# EAGLE design Supply&433Mhz (EAGLE 7.7.0)
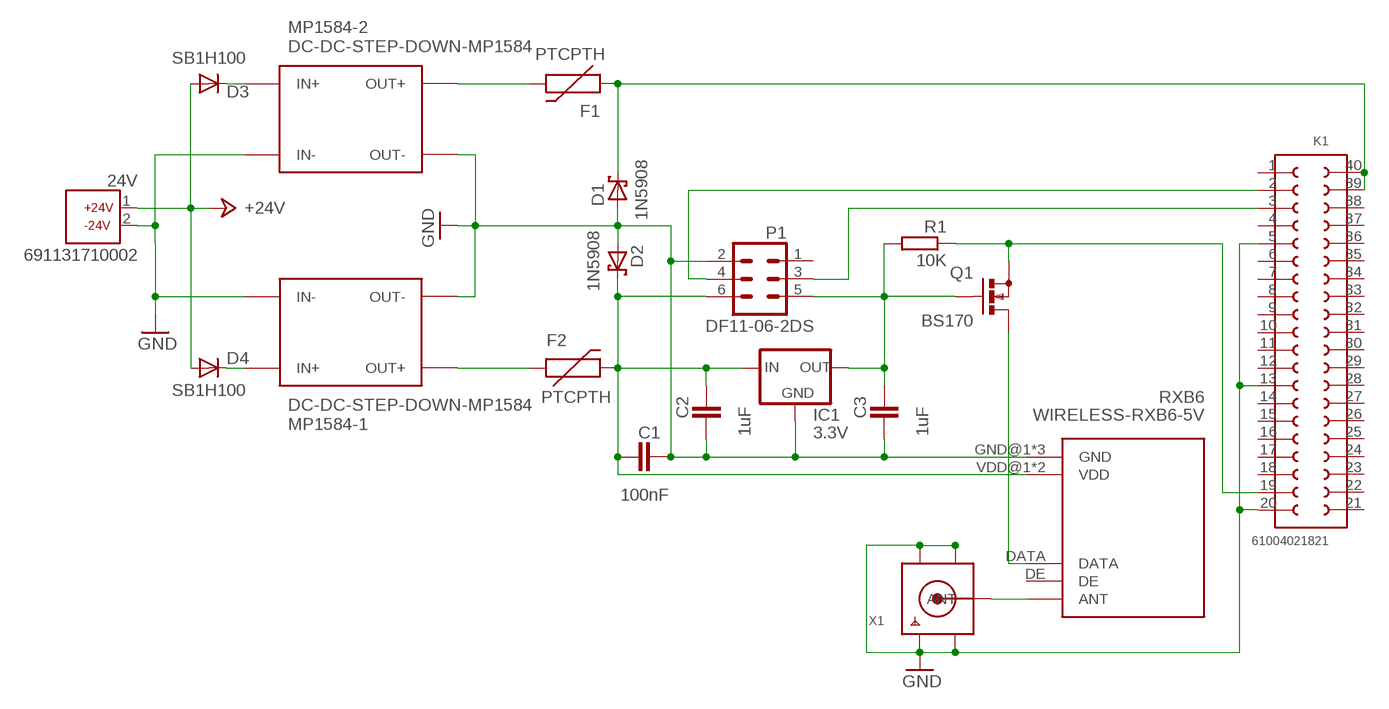
[diagram p0: schematic, sheet 1]

## Parts
24V  691131710002  [691131710002]
C1  100nF  C2,5-3  [C2.5-3]
C2  1uF  C5/3  [C5B3]
C3  1uF  C5/3  [C5B3]
D1  1N5908  [C4111-15]
D2  1N5908  [C4111-15]
D3  SB1H100  DIODE-DO41-7.6  [DO41-7.6]
D4  SB1H100  DIODE-DO41-7.6  [DO41-7.6]
F1  PTCPTH  [PTC]
F2  PTCPTH  [PTC]
IC1  3.3V  MCP1700INLINE  [TO92-INLINE]
K1  61004021821  [61004021821]
MP1584-1  DC-DC-STEP-DOWN-MP1584  [DC-DC-STEP-DOWN-MP1584]
MP1584-2  DC-DC-STEP-DOWN-MP1584  [DC-DC-STEP-DOWN-MP1584]
P1  DF11-06-2DS  [DF11-06DP-2DS]
Q1  BS170  [SOT54E]
R1  10K  R-EU_0204/2V  [0204V]
RXB6  WIRELESS-RXB6-5V  [WIRELESS-RXB6-5V]
X1  SMACONNECTOR  [SMA90_DIP]

## Nets
+24V: 24V.1 D3.A D4.A
GND: 24V.2 C1.1 C2.2 C3.2 D1.A D2.A IC1.1(GND) K1.5 K1.13 K1.20 MP1584-1.IN-0(IN-) MP1584-1.IN-1(IN-) MP1584-1.OUT-0(OUT-) MP1584-1.OUT-1(OUT-) MP1584-2.IN-0(IN-) MP1584-2.IN-1(IN-) MP1584-2.OUT-0(OUT-) MP1584-2.OUT-1(OUT-) P1.2 RXB6.GND@1(GND) RXB6.GND@2(GND) RXB6.GND@3(GND) X1.GND1 X1.GND2 X1.GND3 X1.GND4
N$1: K1.3 P1.3
N$2: C1.2 C2.1 D2.C F2.P$2 IC1.2(IN) P1.6 RXB6.VDD@1(VDD) RXB6.VDD@2(VDD)
N$3: Q1.D RXB6.DATA
N$4: F1.P$2 MP1584-2.OUT+0(OUT+) MP1584-2.OUT+1(OUT+)
N$5: D1.C F1.P$1 K1.39 K1.40
N$6: F2.P$1 MP1584-1.OUT+0(OUT+) MP1584-1.OUT+1(OUT+)
N$7: D3.C MP1584-2.IN+0(IN+) MP1584-2.IN+1(IN+)
N$8: RXB6.ANT X1.ANTENNA(ANT)
N$9: D4.C MP1584-1.IN+0(IN+) MP1584-1.IN+1(IN+)
N$11: C3.1 IC1.3(OUT) P1.5 Q1.G R1.2
N$12: K1.2 P1.4
N$69: K1.19 Q1.S R1.1
Unconnected: K1.1 K1.4 K1.6 K1.7 K1.8 K1.9 K1.10 K1.11 K1.12 K1.14 K1.15 K1.16 K1.17 K1.18 K1.21 K1.22 K1.23 K1.24 K1.25 K1.26 K1.27 K1.28 K1.29 K1.30 K1.31 K1.32 K1.33 K1.34 K1.35 K1.36 K1.37 K1.38 P1.1 RXB6.DE

## Notes on the sheet
- +24V
- -24V

## Library data of the parts
24V = con-wuerth:691131710002: WR-TBL Terminal block - CUU5/2 CUU5/2GR - 2 Pins;=>Code : Con_TBL_Screw_PClamp_5.00_6911317100xx_691131710002 <http://katalog.we-online.de/media/images/eican/Con_TBL_Screw_PClamp_5.00_6911317100xx_pf2.jpg> Details see: http://katalog.we-online.de/em/datasheet/6911317100xx.pdf Created 11/23/2014, Karrer Zheng 2014 (C) Wurth Elektronik
C1-C3 = capacitor-wima:C: CAPACITOR naming: grid - package width
D1 D2 = diode:1N5908: DIODE schottky
D3 D4 = diode:DIODE-: DIODE
F1 F2 = SparkFun-PowerIC:PTC: Resettable Fuse PTC Resettable Fuse. Spark Fun Electronics SKU : COM-08357
IC1 = adafruit:MCP1700: VOLTAGE REGULATOR
K1 = Board_to_Board_Connectors_rev15d:61004021821: WR-PHD 2.54mm Dual SMT Socket Header, 40 Pins=>Code : Con_BTB_SHD_2.54_1_SMT_61000421821 <http://katalog.we-online.de/media/images/eican/Con_BTB_SHD_2.54_1_SMT_6100xx21821_pf2.jpg> Details see: http://katalog.we-online.de/en/em/610_0xx_218_21 Created 2014-05-30, Karrer Zheng 2014 (C) Würth Elektronik
MP1584-1 MP1584-2 = diy-modules:DC-DC-STEP-DOWN-MP1584: DC/DC Step-Down Regulator based on MP1584 chip
P1 = con-hirose-df11:DF11-06-2: HEADER
Q1 = transistor-small-signal:BS170: N-CHANNEL MOS FET; MF: ON SEMICONDUCTOR; MPN: BS170G; OC_FARNELL: 9556192
R1 = rcl:R-EU_: RESISTOR, European symbol; OC_FARNELL: unknown
RXB6 = diy-modules:WIRELESS-RXB6-5V: RF Wireless RXB6-5V Receiver
X1 = adafruit:SMACONNECTOR: SMA Connector 90° DIP SMA Connector, 50 Ohm (4UConnector: 07259)

## Net classes
0 default: clearance 0.205 mm

## Board
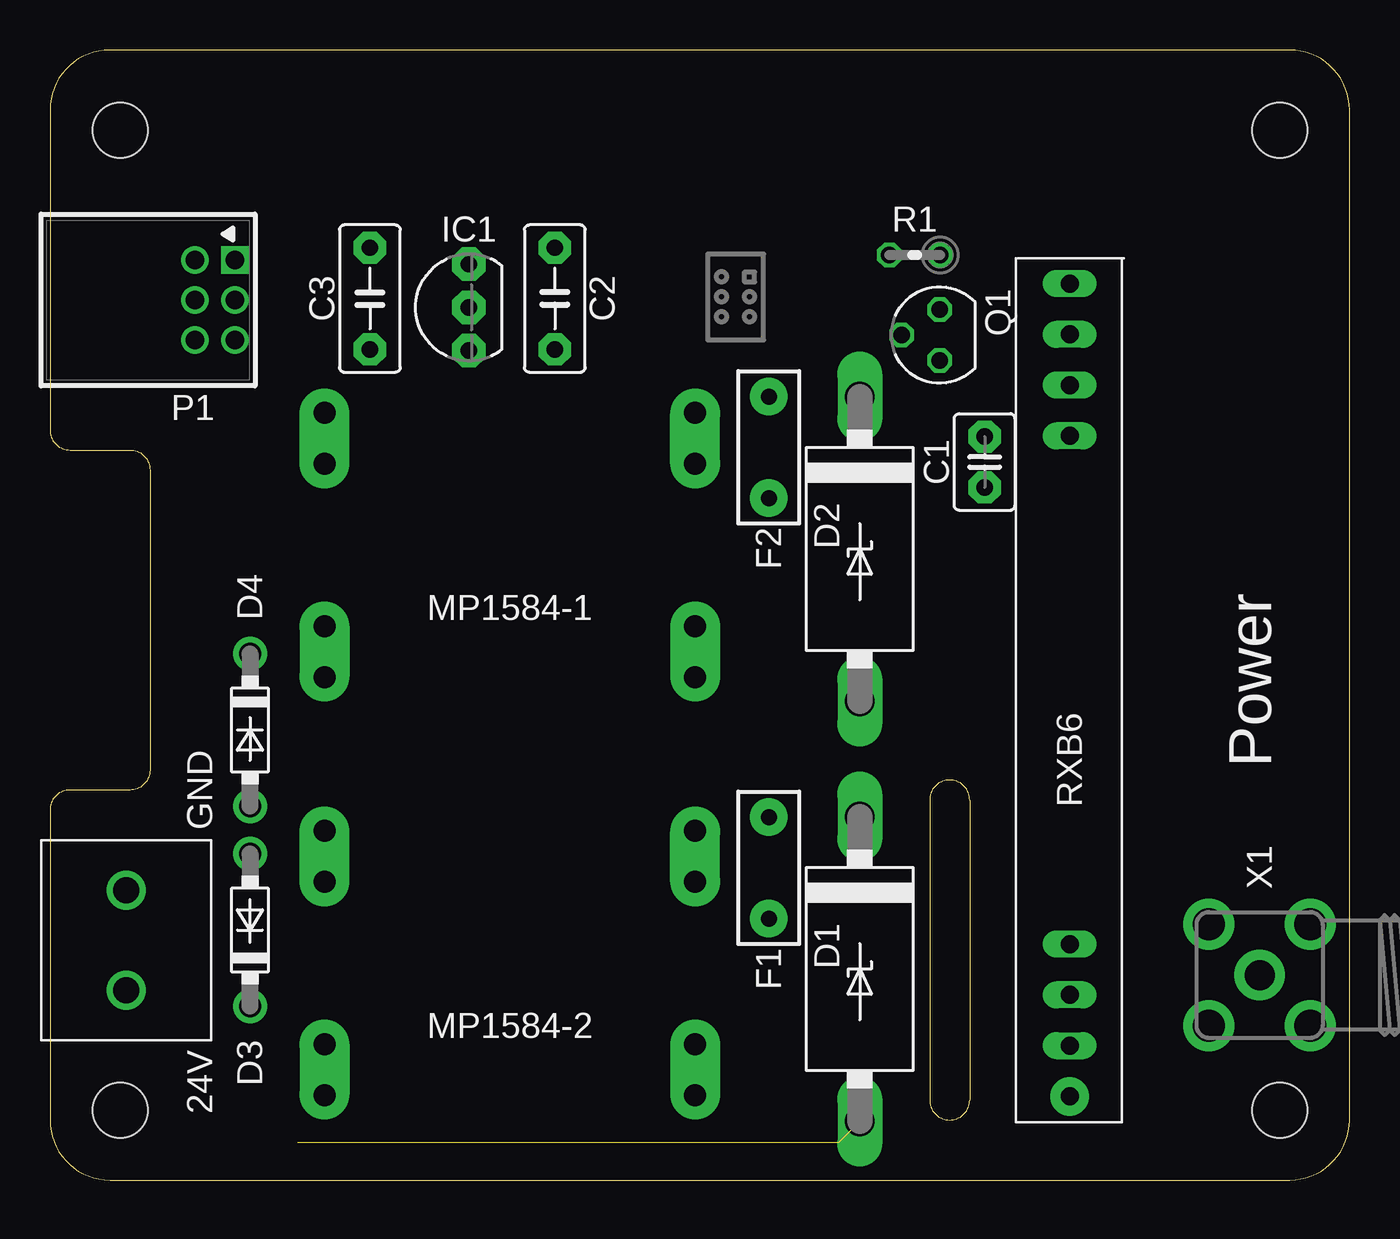
[diagram p1: board, top side]
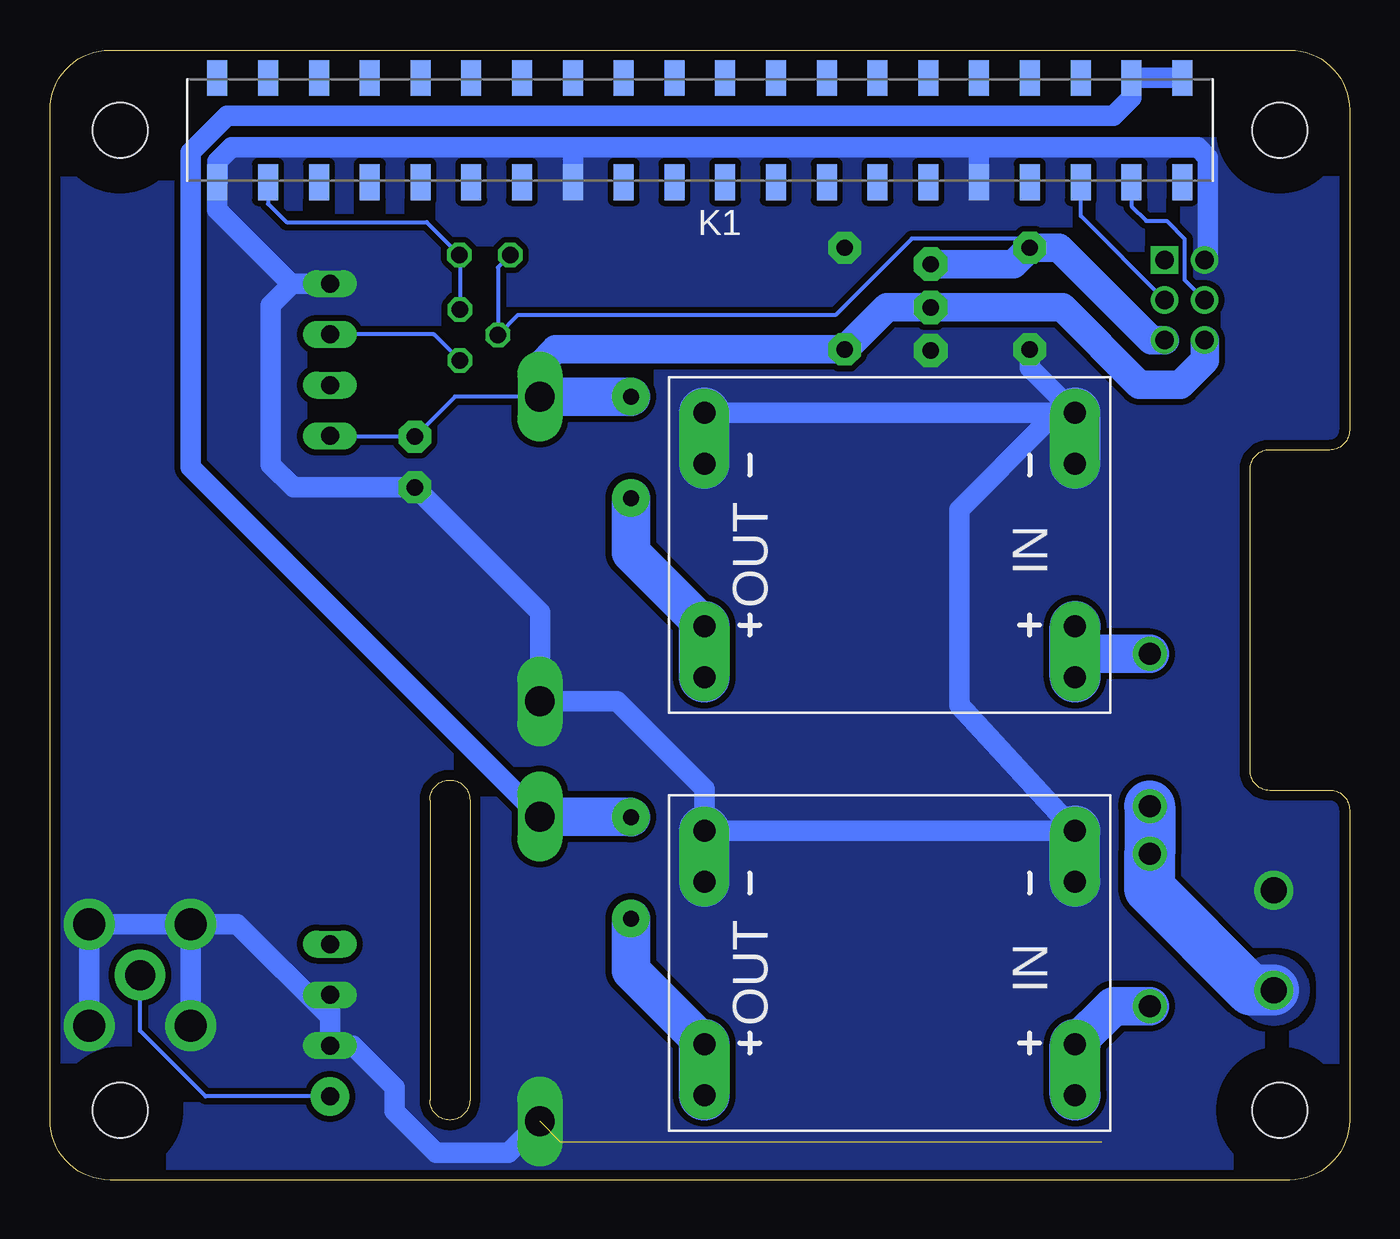
[diagram p2: board, bottom side, seen from below]

Size 65 x 56.5 mm. Coordinates in mm from the lower left corner, seen from the top.
Outline: 3,0 62,0 arc90 65,3 65,53.5 arc90 62,56.5 3,56.5 arc90 0,53.5 0,37.5 arc90 1,36.5 4,36.5 arc-90 5,35.5 5,20.5 arc-90 4,19.5 1,19.5 arc90 0,18.5 0,3 arc90 3,0
Outline: 44,19 44,4 arc90 45,3 arc90 46,4 46,19 arc90 45,20 arc90 44,19
Copper layers (1*16): Top 0.035mm / dielectric 1.6mm / Bottom 0.035mm
Design rules "Elecrow": minimum track width 6mil, minimum drill 12mil, track to track 6mil, track to pad 6mil, pad to pad 6mil, via to via 8mil, smd to smd 0mil, copper to edge 20mil, drill to drill 10mil, minimum pad ring 6mil, minimum via ring 6mil, stop-mask expansion 0mil, vias tented up to drill 100mil, thermal gap 10mil
Holes 2.75 mm at 3.5,3.5 61.5,3.5 61.5,52.5 3.5,52.5
bRestrict: area 58.6,0.6 to 64.3,6.3; area 0.6,49.6 to 6.3,55.4; area 58.6,49.6 to 64.3,55.4; area 0.6,0.6 to 6.3,6.3

### Footprints (pad centres in the part's own frame; a part is rotated, then mirrored left to right if it is on the bottom)
691131710002 = drill 1.3: 1 -2.5,0; 2 2.5,0
C2.5-3 = drill 0.813 pad 1.6 octagon: 1 -1.27,0; 2 1.27,0
C5B3 = drill 0.813 pad 1.6 octagon: 1 -2.54,0; 2 2.54,0
C4111-15 = drill 1.499 long: A 7.62,0; C -7.62,0
DO41-7.6 = drill 1.1 pad 1.7: A 3.81,0; C -3.81,0
PTC = drill 0.8 pad 1.88: P$1 -2.54,0; P$2 2.54,0
TO92-INLINE = drill 0.813 pad 1.676 octagon: 1 -2.159,0; 2 0,0; 3 2.159,0
61004021821 = smd 1 x 1.8: 1 -24.13,2.6; 2 -21.59,2.6; 3 -19.05,2.6; 4 -16.51,2.6; 5 -13.97,2.6; 6 -11.43,2.6; 7 -8.89,2.6; 8 -6.35,2.6; 9 -3.81,2.6; 10 -1.27,2.6; 11 1.27,2.6; 12 3.81,2.6; 13 6.35,2.6; 14 8.89,2.6; 15 11.43,2.6; 16 13.97,2.6; 17 16.51,2.6; 18 19.05,2.6; 19 21.59,2.6; 20 24.13,2.6; 21 24.13,-2.6; 22 21.59,-2.6; 23 19.05,-2.6; 24 16.51,-2.6; 25 13.97,-2.6; 26 11.43,-2.6; 27 8.89,-2.6; 28 6.35,-2.6; 29 3.81,-2.6; 30 1.27,-2.6; 31 -1.27,-2.6; 32 -3.81,-2.6; 33 -6.35,-2.6; 34 -8.89,-2.6; 35 -11.43,-2.6; 36 -13.97,-2.6; 37 -16.51,-2.6; 38 -19.05,-2.6; 39 -21.59,-2.6; 40 -24.13,-2.6
DC-DC-STEP-DOWN-MP1584 = drill 1.1 pad 2.5 offset: IN+0 -9.271,4.064; IN-0 -9.271,-4.064; OUT+0 9.271,4.064; OUT-0 9.271,-4.064 | drill 1.1: IN+1 -9.271,6.604; IN-1 -9.271,-6.604; OUT+1 9.271,6.604; OUT-1 9.271,-6.604
DF11-06DP-2DS = drill 0.914 square: 1 2,-1 | drill 0.914: 2 2,1; 3 0,-1; 4 0,1; 5 -2,-1; 6 -2,1
SOT54E = drill 0.813 octagon: D -1.27,0; G 0,1.905; S 1.27,0
0204V = drill 0.813 octagon: 1 -1.27,0; 2 1.27,0
WIRELESS-RXB6-5V = drill 0.9 pad 1.93: ANT -20.32,0 | drill 0.9 long: DATA 17.78,0; DE 15.24,0; GND@1 20.32,0; GND@2 -15.24,0; GND@3 -17.78,0; VDD@1 12.7,0; VDD@2 -12.7,0
SMA90_DIP = drill 1.5 pad 2.54: ANTENNA 0,0 | drill 1.6 pad 2.54: GND1 -2.54,2.54; GND2 2.54,2.54; GND3 -2.54,-2.54; GND4 2.54,-2.54

### Placement (x,y rotation side)
24V  3.8,12 90 top
C1  46.75,35.9 90 top
C2  25.25,44.07 90 top
C3  16,44.07 270 top
D1  40.5,10.55 270 top
D2  40.5,31.55 270 top
D3  10,12.5 90 top
D4  10,22.5 270 top
F1  35.95,15.61 270 top
F2  35.95,36.63 90 top
IC1  20.95,43.63 90 top
K1  32.5,52.5 180 bottom
MP1584-1  23,31.75 180 bottom
MP1584-2  23,10.85 180 bottom
P1  8.25,44 90 top
Q1  44.5,42.25 90 top
R1  43.25,46.25 180 top
RXB6  51,24.5 90 top
X1  60.5,10.25 270 top

### Tracks (layer width: path | path; a pad name or v marks a point on that pad's centre or on a via)
+24V
  Bottom 2.54: D4.A D3.A 10,14.57 4.93,9.5 24V.1
  pour Bottom (no thermals): 2.7,8.3 arc180 4.9,10.7 arc180
GND  (2 unrouted)
  Bottom 1.016: 18.53,51.63 38.84,51.63 | 38.84,51.63 55.92,51.63 56.61,50.94 56.61,49.92 K1.20 56.63,48.51 52.91,44.79 | K1.5 18.53,51.63 | K1.13 38.84,49.93 38.84,51.63 | RXB6.GND@3 RXB6.GND@2 | X1.GND3 X1.GND1 X1.GND2 | 18.53,51.63 7.6,51.63 7.08,51.11 7.08,46.17 P1.2 | RXB6.GND@3 49.83,6.72 47.76,4.65 47.76,3.45 45.68,1.37 42.06,1.37 D1.A | MP1584-1.IN-1 MP1584-1.OUT-1 | MP1584-1.IN-1 15.23,37.8 19.52,33.51 19.52,23.75 MP1584-2.IN-1 MP1584-2.OUT-1 32.27,19.55 36.65,23.93 D2.A 40.5,28.38 C1.1 52.82,34.63 53.95,35.76 53.95,43.75 52.91,44.79 | RXB6.GND@3 51,8.16 55.63,12.79 X1.GND3 | RXB6.GND@1 52.88,44.82 52.91,44.79 | C3.2 16,40.62 MP1584-1.IN-1 | X1.GND4 X1.GND3
  Bottom 2.54: MP1584-2.OUT-0 MP1584-2.OUT-1 | MP1584-1.IN-1 MP1584-1.IN-0 | MP1584-2.IN-0 MP1584-2.IN-1 | MP1584-1.OUT-0 MP1584-1.OUT-1
  pour Bottom (isolate 0.305, rank 2, no thermals): 0,0 0,51.63 65,51.63 65,0
  pour Bottom (no thermals): 2.7,13.2 arc180 4.9,15.7 arc180
N$1
  Bottom 0.203: P1.3 13.45,48.2 K1.3
N$2
  Bottom 0.203: D2.C 44.75,39.17 C1.2 50.97,37.17 RXB6.VDD@1
  Bottom 1.422: P1.6 7.25,40.99 8.47,39.77 10.51,39.77 14.37,43.63 IC1.2 23.15,43.63 C2.1 39.71,41.53 40.5,40.74 D2.C
  Bottom 1.93: F2.P$2 D2.C
N$3
  Bottom 0.203: Q1.D 45.8,42.28 RXB6.DATA
N$4
  Bottom 1.93: MP1584-2.OUT+0 35.95,10.46 F1.P$2
  Bottom 2.54: MP1584-2.OUT+1 MP1584-2.OUT+0
N$5
  Bottom 1.016: K1.40 K1.39 10.91,54.12 11.81,53.22 56.13,53.22 57.97,51.38 57.97,35.64 D1.C
  Bottom 1.93: F1.P$1 35.98,18.17 D1.C
N$6
  Bottom 1.93: MP1584-1.OUT+0 35.95,31.36 F2.P$1
  Bottom 2.54: MP1584-1.OUT+1 MP1584-1.OUT+0
N$7
  Bottom 1.93: D3.C 11.82,8.69 MP1584-2.IN+0
  Bottom 2.54: MP1584-2.IN+1 MP1584-2.IN+0
N$8
  Bottom 0.203: RXB6.ANT 57.22,4.18 60.5,7.46 X1.ANTENNA
N$9
  Bottom 1.93: D4.C 13.53,26.31 13.73,26.11
  Bottom 2.54: MP1584-1.IN+1 13.73,26.11 MP1584-1.IN+0
N$11
  Bottom 0.203: 42.58,42.23 Q1.G | R1.2 42.59,45.63 Q1.G | C3.1 16.02,46.61 16.48,47.07 21.89,47.07 25.72,43.24 41.6,43.24 Q1.G
  Bottom 1.422: P1.5 9.92,42 14.53,46.61 C3.1 16.82,45.79 IC1.3
N$12
  Bottom 0.203: P1.4 8.25,45 8.25,47.05 9.15,47.95 10.17,47.95 10.91,48.69 K1.2
N$69
  Bottom 0.203: Q1.S 44.5,46.23 R1.1 46.16,47.89 53.17,47.89 54.09,48.81 K1.19

### Text on the board
tNames: Power | GND
tDocu: P1 | GND | INT/NC | SDA | SCL | 5.0V | 3.3V